# EAGLE schematic Audio_Blank (EAGLE 9.1.3)
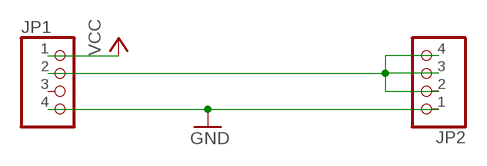
[diagram p0: schematic, sheet 1]

## Parts
JP1  PINHD-1X04_2.54-S  [1X04-S]
JP2  PINHD-1X04_2.54-S  [1X04-S]

## Nets
GND: JP1.4 JP2.1
N$3: JP1.2 JP2.2 JP2.3 JP2.4
VCC: JP1.1
Unconnected: JP1.3

## Library data of the parts
JP1 JP2 = pinhead-2:PINHD-1X04: PIN HEADER